# EAGLE design lmx9838_1 (EAGLE 8.2.2)
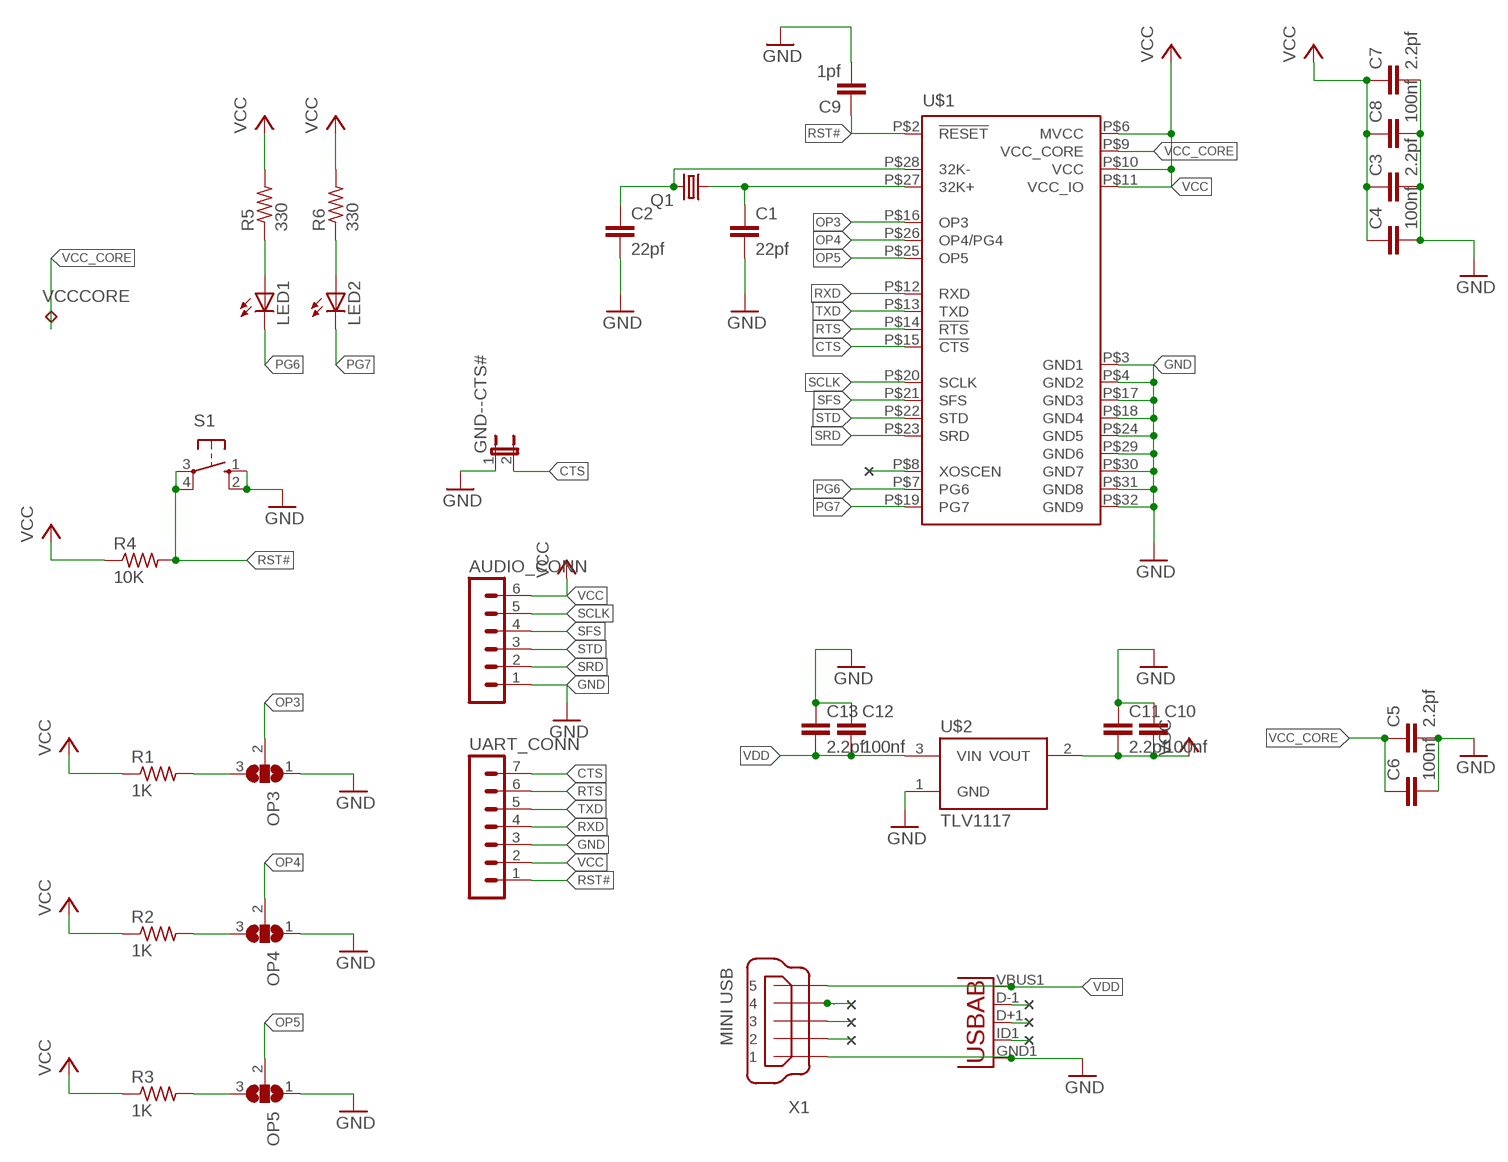
[diagram p0: schematic, sheet 1]

## Parts
AUDIO_CONN  MA06-1  [MA06-1]
C1  22pf  C-EUC0805K  [C0805K]
C2  22pf  C-EUC0805K  [C0805K]
C3  2.2pf  C-EUC0805K  [C0805K]
C4  100nf  C-EUC0805K  [C0805K]
C5  2.2pf  C-EUC0805K  [C0805K]
C6  100nf  C-EUC0805K  [C0805K]
C7  2.2pf  C-EUC0805K  [C0805K]
C8  100nf  C-EUC0805K  [C0805K]
C9  1pf  C-EUC0805K  [C0805K]
C10  100nf  C-EUC0805K  [C0805K]
C11  2.2pf  C-EUC0805K  [C0805K]
C12  100nf  C-EUC0805K  [C0805K]
C13  2.2pf  C-EUC0805K  [C0805K]
GND--CTS#  JP1E  [JP1]
LED1  LEDCHIPLED_0805  [CHIPLED_0805]
LED2  LEDCHIPLED_0805  [CHIPLED_0805]
OP3  SJ2W  [SJ_2]
OP4  SJ2W  [SJ_2]
OP5  SJ2W  [SJ_2]
Q1  CRYSTALTC26H  [TC26H]
R1  1K  R-US_R0805  [R0805]
R2  1K  R-US_R0805  [R0805]
R3  1K  R-US_R0805  [R0805]
R4  10K  R-US_R0805  [R0805]
R5  330  R-US_R0805  [R0805]
R6  330  R-US_R0805  [R0805]
S1  10-XX  [B3F-10XX]
U1  USB""  [USB-MICRO-SMD]
U$1  LMX9838  [LTCC70]
U$2  TLV1117  [SOT223]
UART_CONN  MA07-1  [MA07-1]
VCCCORE  TPB1,27  [B1,27]
X1  MINI USB  MINI-USB-SHIELD-UX60-MB-5ST  [UX60-MB-5ST]

## Nets
CTS: GND--CTS#.2 U$1.P$15(!CTS) UART_CONN.7
GND: AUDIO_CONN.1 C1.2 C2.2 C3.2 C4.2 C5.2 C6.2 C7.2 C8.2 C9.2 C10.1 C11.1 C12.1 C13.1 GND--CTS#.1 OP3.1 OP4.1 OP5.1 S1.1(S) S1.2(S1) U1.GND1(GND) U$1.P$3(GND1) U$1.P$4(GND2) U$1.P$17(GND3) U$1.P$18(GND4) U$1.P$24(GND5) U$1.P$29(GND6) U$1.P$30(GND7) U$1.P$31(GND8) U$1.P$32(GND9) U$2.1(GND) UART_CONN.3 X1.1
N$2: OP3.3 R1.2
N$3: OP4.3 R2.2
N$4: OP5.3 R3.2
N$9: LED1.A R5.1
N$10: C2.1 Q1.2 U$1.P$28(32K-)
N$11: C1.1 Q1.1 U$1.P$27(32K+)
N$12: LED2.A R6.1
N$17: X1.4
N$18: U$1.P$8(XOSCEN)
N$19: X1.2
N$20: X1.3
N$21: U1.D-1(D-)
N$22: U1.D+1(D+)
N$23: U1.ID1(USBID)
OP3: OP3.2 U$1.P$16(OP3)
OP4: OP4.2 U$1.P$26(OP4/PG4)
OP5: OP5.2 U$1.P$25(OP5)
PG6: LED1.C U$1.P$7(PG6)
PG7: LED2.C U$1.P$19(PG7)
RST#: C9.1 R4.2 S1.3(P) S1.4(P1) U$1.P$2(!RESET) UART_CONN.1
RTS: U$1.P$14(!RTS) UART_CONN.6
RXD: U$1.P$12(RXD) UART_CONN.4
SCLK: AUDIO_CONN.5 U$1.P$20(SCLK)
SFS: AUDIO_CONN.4 U$1.P$21(SFS)
SRD: AUDIO_CONN.2 U$1.P$23(SRD)
STD: AUDIO_CONN.3 U$1.P$22(STD)
TXD: U$1.P$13(TXD) UART_CONN.5
VCC: AUDIO_CONN.6 C3.1 C4.1 C7.1 C8.1 C10.2 C11.2 R1.1 R2.1 R3.1 R4.1 R5.2 R6.2 U$1.P$6(MVCC) U$1.P$10(VCC) U$1.P$11(VCC_IO) U$2.2(VOUT) UART_CONN.2
VCC_CORE: C5.1 C6.1 U$1.P$9(VCC_CORE) VCCCORE.TP
VDD: C12.2 C13.2 U1.VBUS1(VBUS) U$2.3(VIN) X1.5
Unconnected: X1.M1(S1) X1.M2(S2) X1.M3(S3) X1.M4(S4)

## Power pins joined to a net without a drawn wire
VOUT2: U$2.4(VOUT2)

## Library data of the parts
AUDIO_CONN = con-lstb:MA06-1: PIN HEADER; OC_FARNELL: unknown; OC_NEWARK: unknown
C1-C13 = rcl:C-EU: CAPACITOR, European symbol
GND--CTS# = jumper:JP1E: JUMPER
LED1 LED2 = led:LED: LED OSRAM: - CHIPLED LG R971, LG N971, LY N971, LG Q971, LY Q971, LO R971, LY R971 LH N974, LH R974 LS Q976, LO Q976, LY Q976 LO Q996 - Hyper CHIPLED LW Q18S LB Q993, LB Q99A, LB R99A - SideLED LS A670, LO A670, LY A670, LG A670, LP A670 LB A673, LV A673, LT A673, LW A673 LH A674 LY A675 LS A676, LA A676, LO A676, LY A676, LW A676 LS A679, LY A679, LG A679 - Hyper Micro SIDELED® LS Y876, LA Y876, LO Y876, LY Y876 LT Y87S - SmartLED LW L88C, LW L88S LB L89C, LB L89S, LG L890 LS L89K, LO L89K, LY L89K LS L896, LA L896, LO L896, LY L896 - TOPLED LS T670, LO T670, LY T670, LG T670, LP T670 LSG T670, LSP T670, LSY T670, LOP T670, LYG T670 LG T671, LOG T671, LSG T671 LB T673, LV T673, LT T673, LW T673 LH T674 LS T676, LA T676, LO T676, LY T676, LB T676, LH T676, LSB T676, LW T676 LB T67C, LV T67C, LT T67C, LS T67K, LO T67K, LY T67K, LW E67C LS E67B, LA E67B, LO E67B, LY E67B, LB E67C, LV E67C, LT E67C LW T67C LS T679, LY T679, LG T679 LS T770, LO T770, LY T770, LG T770, LP T770 LB T773, LV T773, LT T773, LW T773 LH T774 LS E675, LA E675, LY E675, LS T675 LS T776, LA T776, LO T776, LY T776, LB T776 LHGB T686 LT T68C, LB T68C - Hyper Mini TOPLED® LB M676 - Mini TOPLED Santana® LG M470 LS M47K, LO M47K, LY M47K Source: http://www.osram.convergy.de LUXEON: - LUMILED® LXK2-PW12-R00, LXK2-PW12-S00, LXK2-PW14-U00, LXK2-PW14-V00 LXK2-PM12-R00, LXK2-PM12-S00, LXK2-PM14-U00 LXK2-PE12-Q00, LXK2-PE12-R00, LXK2-PE12-S00, LXK2-PE14-T00, LXK2-PE14-U00 LXK2-PB12-K00, LXK2-PB12-L00, LXK2-PB12-M00, LXK2-PB14-N00, LXK2-PB14-P00, LXK2-PB14-Q00 LXK2-PR12-L00, LXK2-PR12-M00, LXK2-PR14-Q00, LXK2-PR14-R00 LXK2-PD12-Q00, LXK2-PD12-R00, LXK2-PD12-S00 LXK2-PH12-R00, LXK2-PH12-S00 LXK2-PL12-P00, LXK2-PL12-Q00, LXK2-PL12-R00 Source: www.luxeon.com KINGBRIGHT: KA-3528ASYC Source: www.kingbright.com
OP3-OP5 = jumper:SJ2W: SMD solder JUMPER
Q1 = crystal:CRYSTAL: CRYSTAL; OC_FARNELL: unknown; OC_NEWARK: unknown
R1-R6 = rcl:R-US_: RESISTOR, American symbol
S1 = switch-omron:10-XX: OMRON SWITCH; MPN: B3F-1000; OC_FARNELL: 176432; OC_NEWARK: 36M3542
U1 = MicroUSB:USB: This is a USB AB connector that is compatible with USB OTG. i.e. this connector can serve as a host or device
U$1 = ns_lmx9838:LMX9838: Bluetooth Serial Port Module Manufacturer: National Semiconductor Source: http://www.national.com/mpf/LM/LMX9838.html
U$2 = texas-instruments:TLV1117
UART_CONN = con-lstb:MA07-1: PIN HEADER; OC_FARNELL: unknown; OC_NEWARK: unknown
VCCCORE = testpad:TP: Test pad
X1 = con-hirose:MINI-USB-SHIELD-: MINI USB Connector Source: http://www.hirose.co.jp/cataloge_hp/e24000019.pdf; OC_FARNELL: unknown; OC_NEWARK: unknown

## Net classes
0 default: width 0.203 mm, drill 0.254 mm, clearance 0.381 mm
1 power: width 0.305 mm, drill 0.254 mm, clearance 0.381 mm

## Board
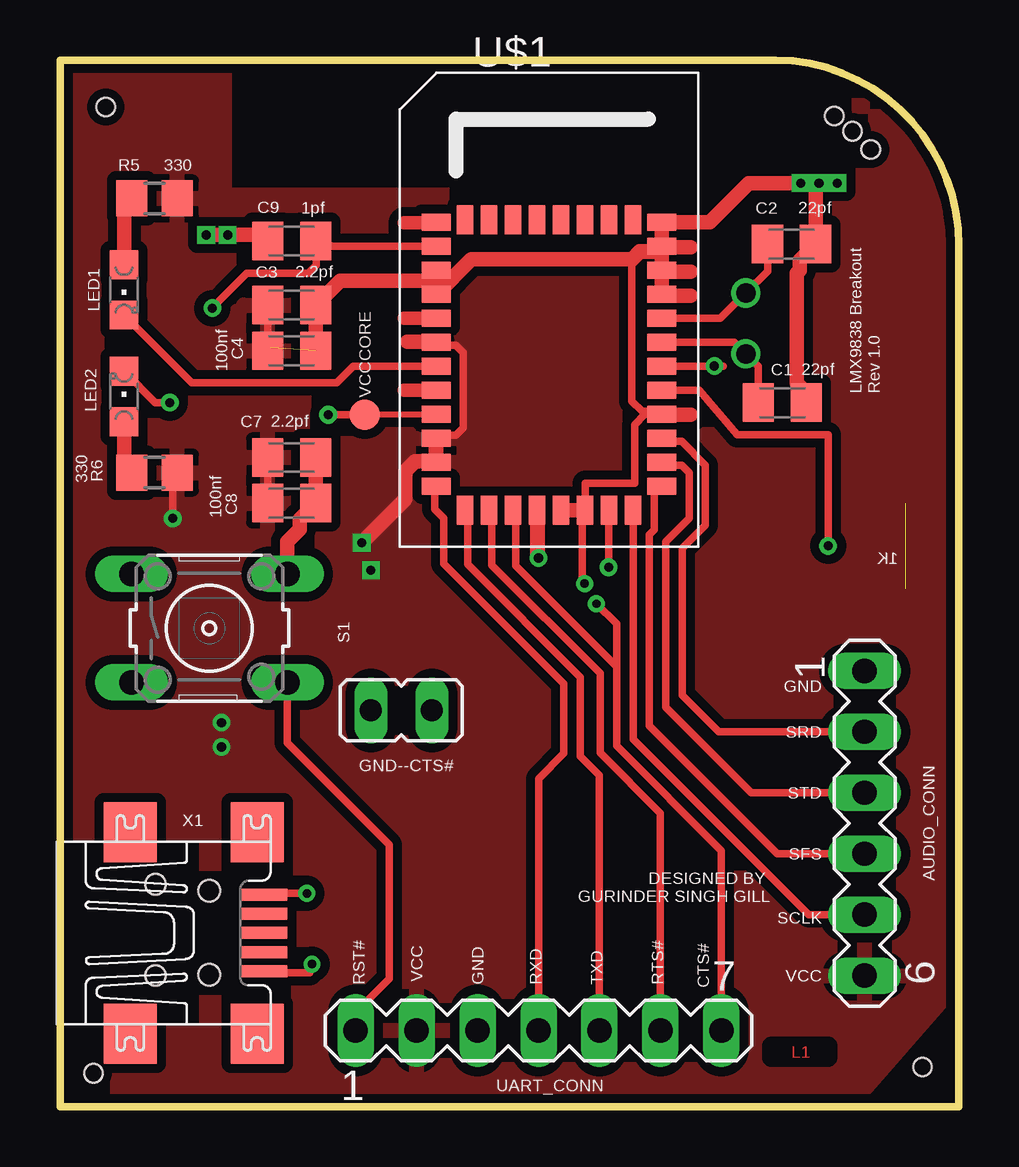
[diagram p1: board, top side]
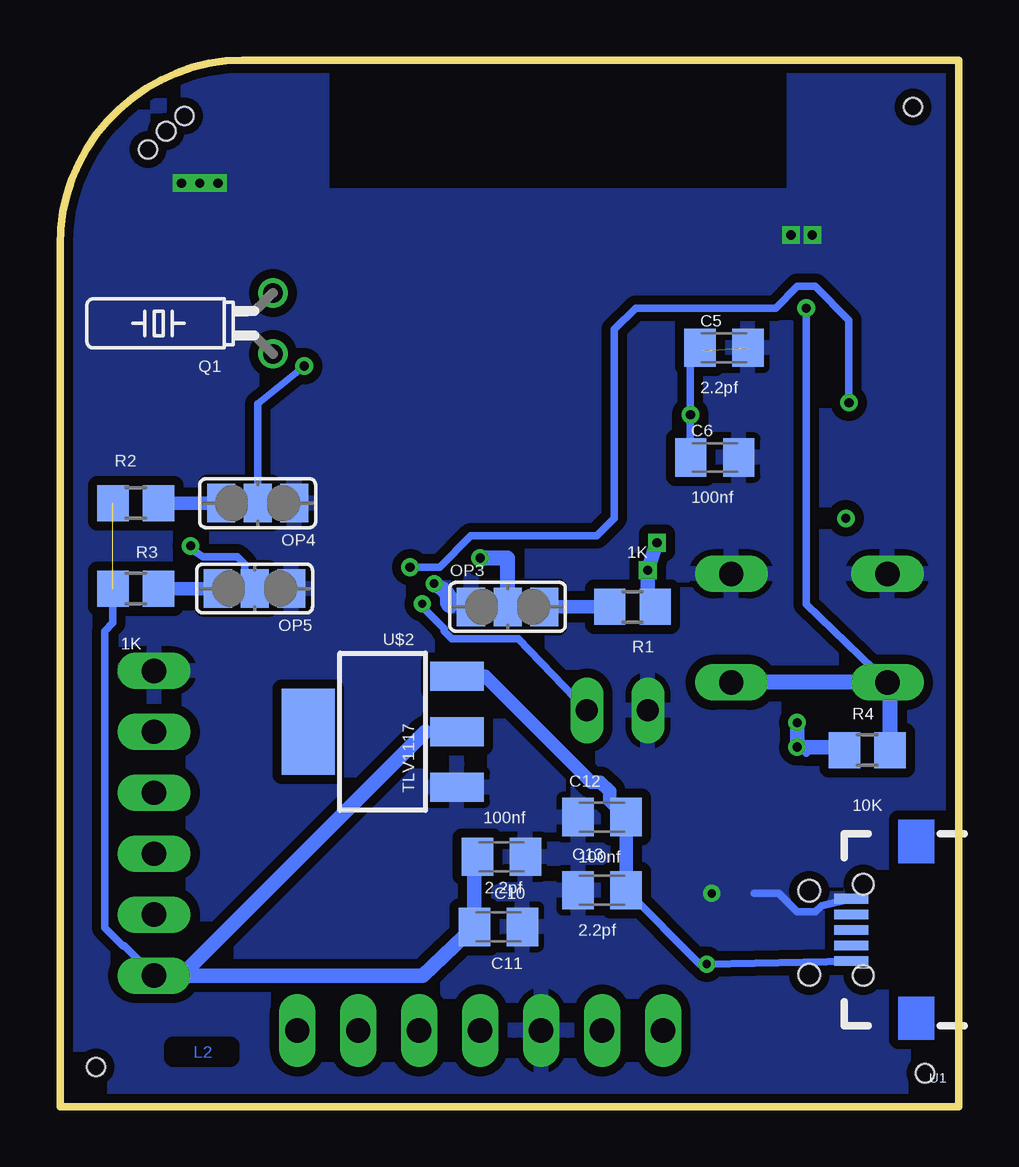
[diagram p2: board, bottom side, seen from below]

Size 37.45 x 43.61 mm. Coordinates in mm from the lower left corner, seen from the top.
Outline: 0,0 37.45,0 37.45,35.87 arc90 29.83,43.61 0,43.61 0,0
Copper layers (1*16): Top 0.0356mm / dielectric 1.5011mm / Bottom 0.0356mm
Design rules "LC_Eagle": minimum track width 8mil, minimum drill 10mil, track to track 8mil, track to pad 8mil, pad to pad 8mil, via to via 8mil, smd to smd 8mil, copper to edge 15mil, drill to drill 8mil, minimum pad ring 7mil, minimum via ring 7mil, stop-mask expansion 4mil, vias tented up to drill 0mil, thermal gap 10mil
Holes 0.76 mm at 1.91,41.66 35.94,1.65 32.26,41.27 33.78,39.88 33.02,40.64 1.4,1.4

### Footprints (pad centres in the part's own frame; a part is rotated, then mirrored left to right if it is on the bottom)
MA06-1 = drill 1.016 long: 1 -6.35,0; 2 -3.81,0; 3 -1.27,0; 4 1.27,0; 5 3.81,0; 6 6.35,0
C0805K = smd 1.3 x 1.6: 1 -1,0; 2 1,0
JP1 = drill 0.914 long: 1 0,-1.27; 2 0,1.27
CHIPLED_0805 = smd 1.2 x 1.2: A 0,-1.05; C 0,1.05
SJ_2 = smd 1.168 x 1.6: 1 -1.524,0; 2 0,0; 3 1.524,0
TC26H = drill 0.813: 1 -1.27,0; 2 1.27,0
R0805 = smd 1.3 x 1.5: 1 -0.95,0; 2 0.95,0
B3F-10XX = drill 1.016 long: 1 -3.251,2.261; 2 3.251,2.261; 3 -3.251,-2.261; 4 3.251,-2.261
USB-MICRO-SMD = smd 1.4 x 0.4: D+1 2.7,0; D-1 2.7,0.65; GND1 2.7,-1.3; ID1 2.7,-0.65; VBUS1 2.7,1.3 | hole 0.85: 2.2,1.9; 2.2,-1.9
LTCC70 = smd 1.2 x 0.7: P$1 -8.2,13; P$2 -8.2,12; P$3 -8.2,11; P$4 -8.2,10; P$5 -8.2,9; P$6 -8.2,8; P$7 -8.2,7; P$8 -8.2,6; P$9 -8.2,5; P$10 -8.2,4; P$11 -8.2,3; P$12 -8.2,2; P$21 1.2,2; P$22 1.2,3; P$23 1.2,4; P$24 1.2,5; P$25 1.2,6; P$26 1.2,7; P$27 1.2,8; P$28 1.2,9; P$29 1.2,10; P$30 1.2,11; P$31 1.2,12; P$32 1.2,13 | smd 0.7 x 1.2: P$13 -7,1; P$14 -6,1; P$15 -5,1; P$16 -4,1; P$17 -3,1; P$18 -2,1; P$19 -1,1; P$20 0,1; P$33 0,13.1; P$34 -1,13.1; P$35 -2,13.1; P$36 -3,13.1; P$37 -4,13.1; P$38 -5,13.1; P$39 -6,13.1; P$40 -7,13.1
SOT223 = smd 1.219 x 2.235: 1 -2.311,-3.099; 2 0,-3.099; 3 2.311,-3.099 | smd 3.6 x 2.2: 4 0,3.099
MA07-1 = drill 1.016 long: 1 -7.62,0; 2 -5.08,0; 3 -2.54,0; 4 0,0; 5 2.54,0; 6 5.08,0; 7 7.62,0
B1,27 = smd 1.27 x 1.27: TP 0,0
UX60-MB-5ST = smd 2 x 0.5: 1 2.25,1.6; 2 2.25,0.8; 3 2.25,0; 4 2.25,-0.8; 5 2.25,-1.6 | smd 2.2 x 2.5: M1 -3.3,-4.2; M2 -3.3,4.2; M3 2,4.2; M4 2,-4.2 | hole 0.9: 0,-1.75; 0,1.75

### Placement (x,y rotation side)
AUDIO_CONN  33.53,11.81 270 top
C1  30.1,29.34 0 top
C2  30.48,35.94 0 top
C3  9.65,33.4 0 top
C4  9.65,31.5 0 top
C5  9.78,31.62 0 bottom
C6  10.16,27.05 0 bottom
C7  9.65,27.05 0 top
C8  9.65,25.15 0 top
C9  9.65,36.07 180 top
C10  19.05,10.41 180 bottom
C11  19.18,7.49 180 bottom
C12  14.86,12.06 0 bottom
C13  14.86,9.02 0 bottom
GND--CTS#  14.22,16.51 270 top
LED1  2.67,34.04 180 top
LED2  2.67,29.59 0 top
OP3  18.8,20.83 0 bottom
OP4  29.21,25.15 180 bottom
OP5  29.34,21.59 180 bottom
Q1  28.57,32.64 90 bottom
R1  13.59,20.83 180 bottom
R2  34.29,25.15 0 bottom
R3  34.29,21.59 0 bottom
R4  3.81,14.86 0 bottom
R5  3.94,37.85 0 top
R6  3.94,26.42 0 top
S1  6.22,19.94 0 top
U1  1.78,7.37 180 bottom
U$1  23.88,23.85 0 top
U$2  24,15.62 90 bottom
UART_CONN  19.94,3.17 0 top
VCCCORE  12.7,28.83 90 top
X1  6.22,7.24 0 top

### Tracks (layer width: path | path; a pad name or v marks a point on that pad's centre or on a via)
CTS  (via drill 0.35)
  Top 0.305: UART_CONN.7 27.56,10.66 23.19,15.03 23.19,18.33 | U$1.P$15 18.99,24.73 18.99,22.53 23.19,18.33 | v22.35,20.95 23.19,20.12 23.19,18.33
  Bottom 0.305: GND--CTS#.2 18.35,19.49 21.12,19.49 21.44,19.81 21.44,19.91 22.35,20.83 v22.35,20.95
GND  (via drill 0.35, 0.38)  (1 unrouted)
  Top 0.305: U$1.P$31 24.71,35.48 24.23,35.48 23.82,35.08 23.82,29.4 24.25,28.97 24.96,28.97 U$1.P$24 24.37,28.85 23.94,28.42 23.94,25.98 21.88,25.98 U$1.P$18 21.77,24.74 21.77,21.89 v21.86,21.8 | X1.1 8.52,8.89 v10.29,8.89 10.41,8.89
  Top 0.61: U$1.P$29 U$1.P$30 25.08,35.64 | 25.08,35.64 U$1.P$31 U$1.P$32 27.07,36.85 28.7,38.48 v30.86,38.48 v31.62,38.48 | 25.08,35.64 24.16,35.64 23.83,35.31 17.14,35.31 U$1.P$4 U$1.P$3 15.24,34.42 11.67,34.42 C3.2 C4.2 | U$1.P$17 U$1.P$18 | v31.62,38.48 v32.38,38.48 | v31.62,38.48 31.48,38.34 C2.2 30.82,35.28 30.82,34.86 30.69,34.73 30.69,30.14 31.35,29.48 C1.2 | C9.2 8.4,36.32 v6.99,36.32 v6.1,36.32 | C7.2 C8.2 9.99,24.48 9.99,24.06 9.47,23.55 S1.2
  Bottom 0.305: OP3.1 20.57,20.83 21.21,21.46 21.32,21.46 v21.86,21.8 | U1.GND1 5.71,8.38 5.97,8.13 6.73,8.13 7.49,8.89 8.51,8.89
  Bottom 0.635: S1.2 10.56,22.2 | v21.86,21.8 21.45,21.54 21.3,21.39 21.3,20.98 21.18,20.86
  pour Bottom: -0.13,0 37.34,0 37.47,35.56 arc90 29.72,43.56 26.54,43.56 26.54,37.97 6.86,37.97 6.86,43.56 -0.13,43.56
N$1
  Top 0.559: 15.49,36.83 14.35,36.83
N$2
  Bottom 0.559: R1.2 OP3.3
N$3
  Bottom 0.559: OP4.3 R2.2
N$4
  Bottom 0.559: OP5.3 R3.2
N$5
  Top 0.61: 15.75,31.88 14.48,31.88
N$6
  Top 0.61: 25.15,35.81 26.29,35.81
N$7
  Top 0.61: 25.15,34.8 26.29,34.8
N$8
  Top 0.559: 15.65,32.84 14.35,32.84
N$9
  Top 0.61: R5.1 2.67,37.85 LED1.A
N$10
  Top 0.305: U$1.P$28 27.52,32.85 Q1.2 29.48,34.81 C2.1
N$11
  Top 0.305: C1.1 29.1,30.84 Q1.1 28.09,31.85 U$1.P$27
N$12
  Top 0.61: LED2.A 2.67,26.74 R6.1
N$13
  Top 0.61: 25.15,33.78 26.29,33.78
N$15
  Top 0.559: 15.75,29.84 14.35,29.84
N$16
  Top 0.61: 25.15,28.83 26.29,28.83
OP3  (via drill 0.38)
  Top 0.635: U$1.P$16 19.88,22.86 v19.94,22.86
  Bottom 0.635: OP3.2 18.8,22.86 v19.94,22.86
OP4  (via drill 0.38)
  Top 0.305: U$1.P$26 27.64,30.85 v27.27,30.86
  Bottom 0.305: OP4.2 29.21,29.3 v27.27,30.86
OP5  (via drill 0.38)
  Top 0.305: U$1.P$25 26.64,29.85 28.23,28 32,28 v32,23.37
  Bottom 0.305: OP5.2 29.74,21.84 29.74,22.61 30.06,22.92 31.49,22.92 32,23.24 arc116 v32,23.37
PG6
  Top 0.305: U$1.P$7 12.21,30.85 11.52,30.16 5.49,30.16 LED1.C
PG7  (via drill 0.38)
  Top 0.305: U$1.P$19 22.86,24.84 v22.86,22.48 | LED2.C 3.97,29.34 v4.57,29.34
  Bottom 0.305: v22.86,22.48 21.63,22.48 20.32,23.79 15.07,23.79 14.35,24.51 14.35,32.38 13.46,33.27 7.62,33.27 6.72,34.18 5.98,34.18 4.57,32.77 v4.57,29.34
RST#  (via drill 0.38)
  Top 0.305: 9.53,17.63 S1.4 9.47,15.16 13.72,10.92 13.72,5.33 12.32,3.94 UART_CONN.1 | U$1.P$2 11.38,35.85 C9.1 10.67,36.05 10.67,35.05 10.35,34.73 7.78,34.73 6.86,33.81 v6.35,33.27
  Bottom 0.305: S1.3 6.35,20.93 v6.35,33.27
  Bottom 0.635: R4.2 2.86,17.68 S1.3 S1.4
RTS
  Top 0.305: UART_CONN.6 25.02,12.23 22.5,14.74 22.5,18.05 17.99,22.56 17.99,24.73 U$1.P$14
RXD
  Top 0.305: U$1.P$12 15.62,25.85 15.62,24.89 15.99,24.52 15.99,22.62 21,17.61 21,14.73 19.94,13.67 UART_CONN.4
SCLK
  Top 0.305: U$1.P$20 23.88,15.31 31.19,8 AUDIO_CONN.5
SFS
  Top 0.305: U$1.P$21 24.76,25.53 24.76,24.03 24.56,23.83 24.56,15.88 29.9,10.54 AUDIO_CONN.4
SRD
  Top 0.305: U$1.P$23 25.19,27.73 25.9,27.73 26.89,26.74 26.89,24.23 25.93,23.26 25.93,17.14 27.46,15.62 AUDIO_CONN.2
STD
  Top 0.305: U$1.P$22 25.19,26.73 25.9,26.73 26.21,26.42 26.21,24.51 25.25,23.55 25.25,16.64 28.8,13.08 AUDIO_CONN.3
TXD
  Top 0.305: UART_CONN.5 22.48,13.8 21.69,14.59 21.69,17.9 16.99,22.59 16.99,24.73 U$1.P$13
VCC  (via drill 0.38)  (1 unrouted)
  Top 0.305: C3.1 C4.1 | C7.1 C8.1 | R6.2 arc-90 4.7,26.6 v4.7,24.51 | U$1.P$10 15.79,27.97 16.5,27.97 16.81,28.28 16.81,31.42 16.5,31.73 15.79,31.73 U$1.P$6
  Top 0.61: v12.57,23.5 14.39,25.31 14.39,26.48 14.79,26.89 15.47,26.89 15.68,27.09
  Top 0.635: U$1.P$10 15.68,27.09 U$1.P$11
  Bottom 0.305: 6.22,14.86 R4.1 | 6.22,14.86 6.35,14.73 | 6.22,14.86 6.6,14.86 v6.73,14.99 | 22.23,15.62 U$2.2 | AUDIO_CONN.6 34.77,6.71 34.83,6.71 35.59,7.46 35.59,19.81 35.24,20.16 R3.1
  Bottom 0.61: 22.23,15.62 32.38,5.46 AUDIO_CONN.6 22.34,5.46 C11.2 20.18,10.29 C10.2 | R4.1 4.89,14.99 v6.73,14.99 v6.73,16 | R1.1 12.95,21.14 v12.95,22.35 v12.57,23.5
  pour Top: 0,0 32.89,0 37.21,4.95 37.21,35.81 arc90 29.84,43.56 26.54,43.56 26.54,37.97 6.86,37.97 6.86,43.56 0,43.56
VCC_CORE  (via drill 0.38)
  Top 0.254: VCCCORE.TP 15.68,28.83 U$1.P$9
  Top 0.305: VCCCORE.TP v11.18,28.83
  Bottom 0.305: C5.1 arc-90 11.18,31.23 v11.18,28.83 11.18,27.07 arc-90 C6.1
VDD  (via drill 0.35)
  Top 0.305: X1.5 8.52,5.59 10.41,5.59 10.41,5.85 v10.5,5.94
  Bottom 0.305: U1.VBUS1 v10.5,5.94 10.78,5.94 C13.2
  Bottom 0.559: C13.2 C12.2 14.55,12.76 14.55,13.14 14.94,13.53 15.32,13.53 19.73,17.93 U$2.3

### Text on the board
Top: L1
Bottom: L2
tPlace: LMX9838 Breakout | Rev 1.0 | GND | SRD | STD | SFS | DESIGNED BY / GURINDER SINGH GILL | SCLK | VCC | RST# | VCC | GND | RXD | TXD | RTS# | CTS#